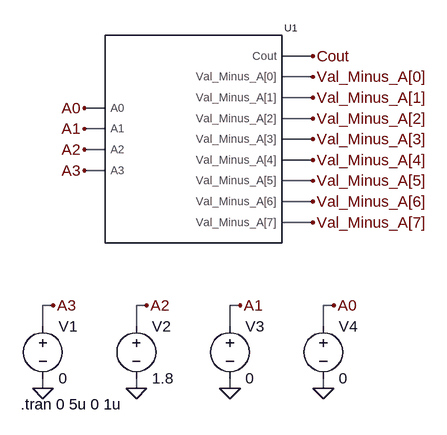
[diagram p0: schematic Val_Minus_A_Test.asc]
Val_Minus_A_Test.asc, the LTspice schematic file:
Version 4
SHEET 1 880 680
WIRE 16 -80 -32 -80
WIRE 16 -48 -32 -48
WIRE 16 -16 -32 -16
WIRE -304 0 -336 0
WIRE 16 16 -32 16
WIRE -304 32 -336 32
WIRE 16 48 -32 48
WIRE -304 64 -336 64
WIRE 16 80 -32 80
WIRE -304 96 -336 96
WIRE 16 112 -32 112
WIRE 16 144 -32 144
WIRE 16 176 -32 176
WIRE -384 304 -400 304
WIRE -240 304 -256 304
WIRE -96 304 -112 304
WIRE 48 304 32 304
WIRE -400 336 -400 304
WIRE -256 336 -256 304
WIRE -112 336 -112 304
WIRE 32 336 32 304
WIRE -400 432 -400 416
WIRE -256 432 -256 416
WIRE -112 432 -112 416
WIRE 32 432 32 416
FLAG -336 0 A0
FLAG -336 32 A1
FLAG -336 64 A2
FLAG -336 96 A3
FLAG 16 -80 Cout
FLAG 16 -48 Val_Minus_A[0]
FLAG 16 -16 Val_Minus_A[1]
FLAG 16 16 Val_Minus_A[2]
FLAG 16 48 Val_Minus_A[3]
FLAG 16 80 Val_Minus_A[4]
FLAG 16 112 Val_Minus_A[5]
FLAG 16 144 Val_Minus_A[6]
FLAG 16 176 Val_Minus_A[7]
FLAG -400 432 0
FLAG -256 432 0
FLAG -112 432 0
FLAG 32 432 0
FLAG -384 304 A3
FLAG -240 304 A2
FLAG -96 304 A1
FLAG 48 304 A0
SYMBOL Val_Minus_A -224 64 R0
SYMATTR InstName U1
SYMBOL voltage -400 320 R0
WINDOW 123 0 0 Left 0
WINDOW 39 0 0 Left 0
SYMATTR InstName V1
SYMATTR Value 0
SYMBOL voltage -256 320 R0
WINDOW 123 0 0 Left 0
WINDOW 39 0 0 Left 0
SYMATTR InstName V2
SYMATTR Value 1.8
SYMBOL voltage -112 320 R0
WINDOW 123 0 0 Left 0
WINDOW 39 0 0 Left 0
SYMATTR InstName V3
SYMATTR Value 0
SYMBOL voltage 32 320 R0
WINDOW 123 0 0 Left 0
WINDOW 39 0 0 Left 0
SYMATTR InstName V4
SYMATTR Value 0
TEXT -434 456 Left 2 !.tran 0 5u 0 1u

The netlist it stands for:
* Val_Minus_A_Test.asc
XU1 A0 A1 A2 A3 Cout Val_Minus_A[0] Val_Minus_A[1] Val_Minus_A[2] Val_Minus_A[3] Val_Minus_A[4] Val_Minus_A[5] Val_Minus_A[6] Val_Minus_A[7] Val_Minus_A  ; pins A0 A1 A2 A3 Cout Val_Minus_A[0] Val_Minus_A[1] Val_Minus_A[2] Val_Minus_A[3] Val_Minus_A[4] Val_Minus_A[5] Val_Minus_A[6] Val_Minus_A[7]
V1 A3 0 0
V2 A2 0 1.8
V3 A1 0 0
V4 A0 0 0
.tran 0 5u 0 1u
.lib Val_Minus_A.sub
.backanno
.end